# EAGLE design week7 (EAGLE 8.6.0)
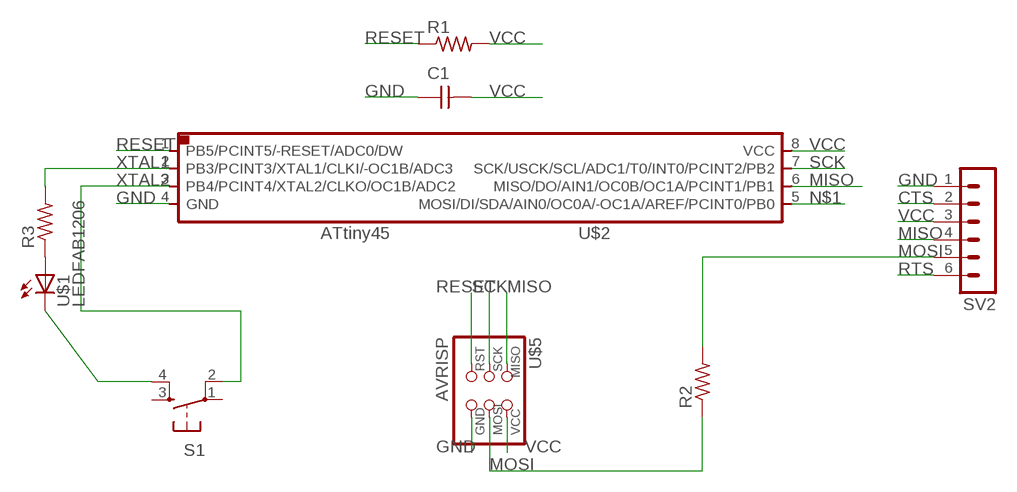
[diagram p0: schematic, sheet 1]

## Parts
C1  CAP-UNPOLARIZED  [C1206]
R1  RES-US1206FAB  [R1206FAB]
R2  RES-US1206FAB  [R1206FAB]
R3  RES-US1206FAB  [R1206FAB]
S1  6MM_SWITCH6MM_SWITCH  [6MM_SWITCH]
SV2  MA06-1  [MA06-1]
U$1  LEDFAB1206  [LED1206FAB]
U$2  ATTINY45SI  [SOIC8]
U$5  AVRISP  [2X03]

## Nets
CTS: SV2.2
GND: C1.1 S1.4(S1) SV2.1 U$1.2(C) U$2.4(GND) U$5.6(GND)
MISO: SV2.4 U$2.6(MISO/DO/AIN1/OC0B/OC1A/PCINT1/PB1) U$5.1(MISO)
MOSI: R2.1 R2.2 SV2.5 U$5.4(MOSI)
N$1: U$2.5(MOSI/DI/SDA/AIN0/OC0A/-OC1A/AREF/PCINT0/PB0)
N$2: R3.1 U$1.1(A)
RESET: R1.1 U$2.1(PB5/PCINT5/-RESET/ADC0/DW) U$5.5(RST)
RTS: SV2.6
SCK: U$2.7(SCK/USCK/SCL/ADC1/T0/INT0/PCINT2/PB2) U$5.3(SCK)
VCC: C1.2 R1.2 SV2.3 U$2.8(VCC) U$5.2(VCC)
XTAL1: R3.2 U$2.2(PB3/PCINT3/XTAL1/CLKI/-OC1B/ADC3)
XTAL2: S1.2(P1) U$2.3(PB4/PCINT4/XTAL2/CLKO/OC1B/ADC2)
Unconnected: S1.1(P) S1.3(S)

## Library data of the parts
C1 = fab:CAP-UNPOLARIZED
R1-R3 = fab:RES-US: Resistor (US Symbol) Variants with postfix FAB are widened to allow the routing of internal traces
S1 = fab:6MM_SWITCH: OMRON SWITCH
SV2 = con-lstb:MA06-1: PIN HEADER; OC_FARNELL: unknown; OC_NEWARK: unknown
U$1 = fab:LED: LED
U$2 = fab:ATTINY45
U$5 = fab:AVRISP

## Net classes
0 default: width 0.4 mm, drill 0.4 mm, clearance 0.4 mm

## Board
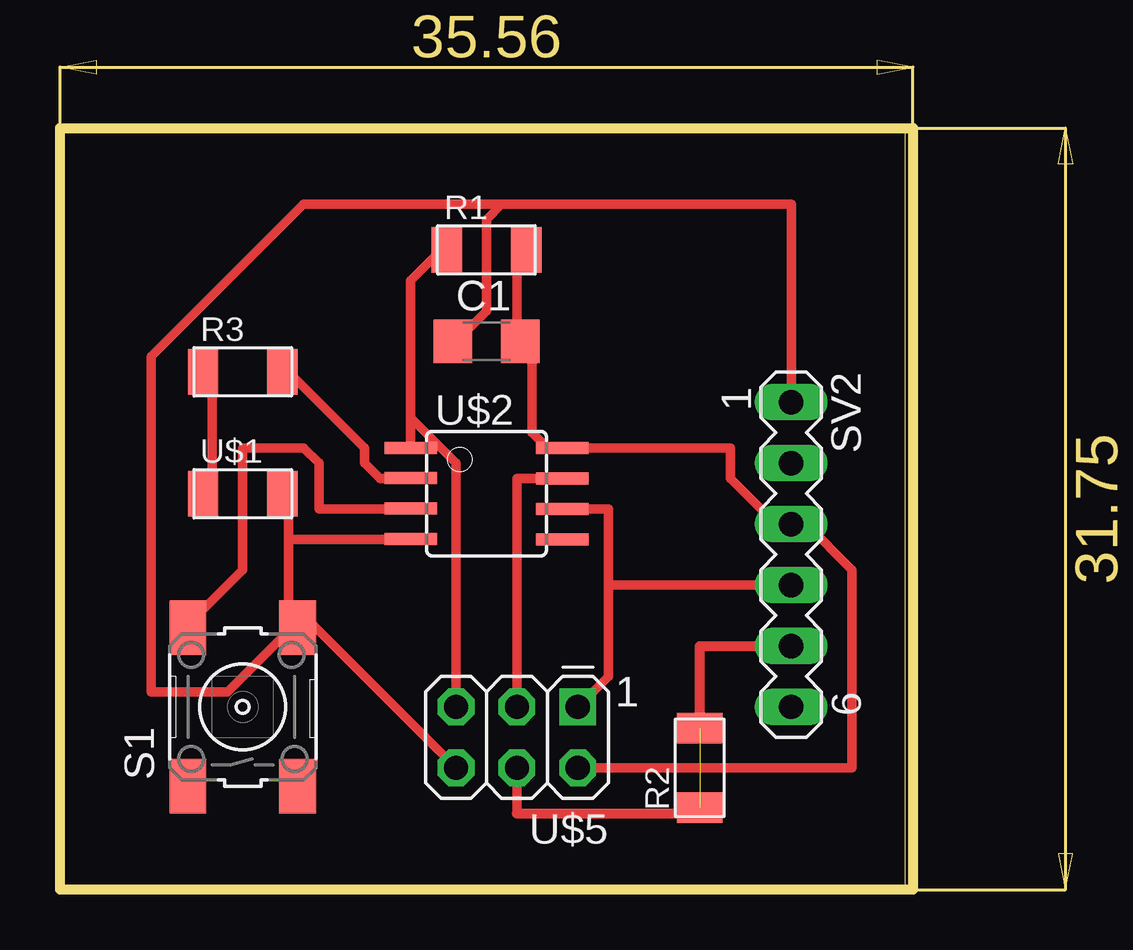
[diagram p1: board, top side]

Size 35.56 x 31.75 mm. Coordinates in mm from the lower left corner, seen from the top.
Outline: 0,0 35.23,0 35.23,31.74 0,31.74 0,0
Outline: 0,0 35.56,0 35.56,31.75 0,31.75 0,0
Copper layers (1*16): Top 0.035mm / dielectric 1.5mm / Bottom 0.035mm
Design rules "helloecho2": minimum track width 6mil, minimum drill 0.35mm, track to track 0.205mm, track to pad 0.205mm, pad to pad 0.205mm, via to via 0.205mm, smd to smd 6mil, copper to edge 40mil, drill to drill 6mil, minimum pad ring 10mil, minimum via ring 8mil, stop-mask expansion 4mil, vias tented up to drill 0mil, thermal gap 10mil

### Footprints (pad centres in the part's own frame; a part is rotated, then mirrored left to right if it is on the bottom)
C1206 = smd 1.6 x 1.8: 1 -1.4,0; 2 1.4,0
R1206FAB = smd 1.27 x 1.905: 1 -1.651,0; 2 1.651,0
6MM_SWITCH = smd 2.286 x 1.524: 1 -3.302,2.286; 2 3.302,2.286; 3 -3.302,-2.286; 4 3.302,-2.286
MA06-1 = drill 1.016 long: 1 -6.35,0; 2 -3.81,0; 3 -1.27,0; 4 1.27,0; 5 3.81,0; 6 6.35,0
LED1206FAB = smd 1.27 x 1.905: 1 -1.651,0; 2 1.651,0
SOIC8 = smd 0.5 x 2.2: 1 -1.905,-3.154; 2 -0.645,-3.154; 3 0.625,-3.154; 4 1.895,-3.154; 5 1.905,3.154; 6 0.635,3.154; 7 -0.635,3.154; 8 -1.905,3.154
2X03 = drill 1.016 square: 1 -2.54,-1.27 | drill 1.016 octagon: 2 -2.54,1.27; 3 0,-1.27; 4 0,1.27; 5 2.54,-1.27; 6 2.54,1.27

### Placement (x,y rotation side)
C1  17.78,22.86 0 top
R1  17.78,26.67 0 top
R2  26.67,5.08 90 top
R3  7.62,21.59 0 top
S1  7.62,7.62 90 top
SV2  30.48,13.97 270 top
U$1  7.62,16.51 0 top
U$2  17.78,16.51 270 top
U$5  19.05,6.35 180 top

### Tracks (layer width: path | path; a pad name or v marks a point on that pad's centre or on a via)
GND
  Top 0.4: 9.52,14.6 9.52,11.43 S1.4 | 9.52,14.6 9.52,16.51 U$1.2 | 9.52,14.6 14.6,14.6 U$2.4 | U$5.6 10.16,11.43 S1.4 | 18.41,28.57 17.78,27.94 17.78,24.13 16.51,22.86 C1.1 | 18.41,28.57 30.48,28.57 SV2.1 | 18.41,28.57 10.16,28.57 3.81,22.23 3.81,8.26 6.98,8.26 9.52,10.79 S1.4
MISO
  Top 0.4: U$2.6 22.86,15.87 22.86,12.7 | 22.86,12.7 22.86,8.89 U$5.1 | 22.86,12.7 SV2.4
MOSI  (1 unrouted)
  Top 0.4: U$5.4 19.05,3.17
  Top 0.406: 19.05,3.17 26.42,3.17 R2.1 | R2.2 26.67,10.16 SV2.5
N$2
  Top 0.4: U$1.1 6.35,16.51 6.35,21.59 R3.1
RESET
  Top 0.4: 14.6,19.68 14.6,18.41 U$2.1 | 14.6,19.68 14.6,25.4 15.88,26.67 R1.1 | U$5.5 16.51,17.78 14.6,19.68
SCK
  Top 0.4: U$2.7 19.05,17.14 U$5.3
VCC
  Top 0.4: R1.2 19.05,26.67 19.05,22.86 C1.2 19.68,22.86 19.68,19.05 20.32,18.41 U$2.8 27.94,18.41 27.94,17.14 29.84,15.24 SV2.3 31.12,15.24 33.02,13.33 33.02,5.08 U$5.2
XTAL1
  Top 0.4: R3.2 9.52,21.59 12.7,18.41 12.7,17.78 13.33,17.14 14.6,17.14 U$2.2
XTAL2
  Top 0.4: U$2.3 14.6,15.87 10.79,15.87 10.79,17.78 10.16,18.41 7.62,18.41 7.62,13.33 5.71,11.43 S1.2